# Altium schematic sheet Main.SchDoc
size A4
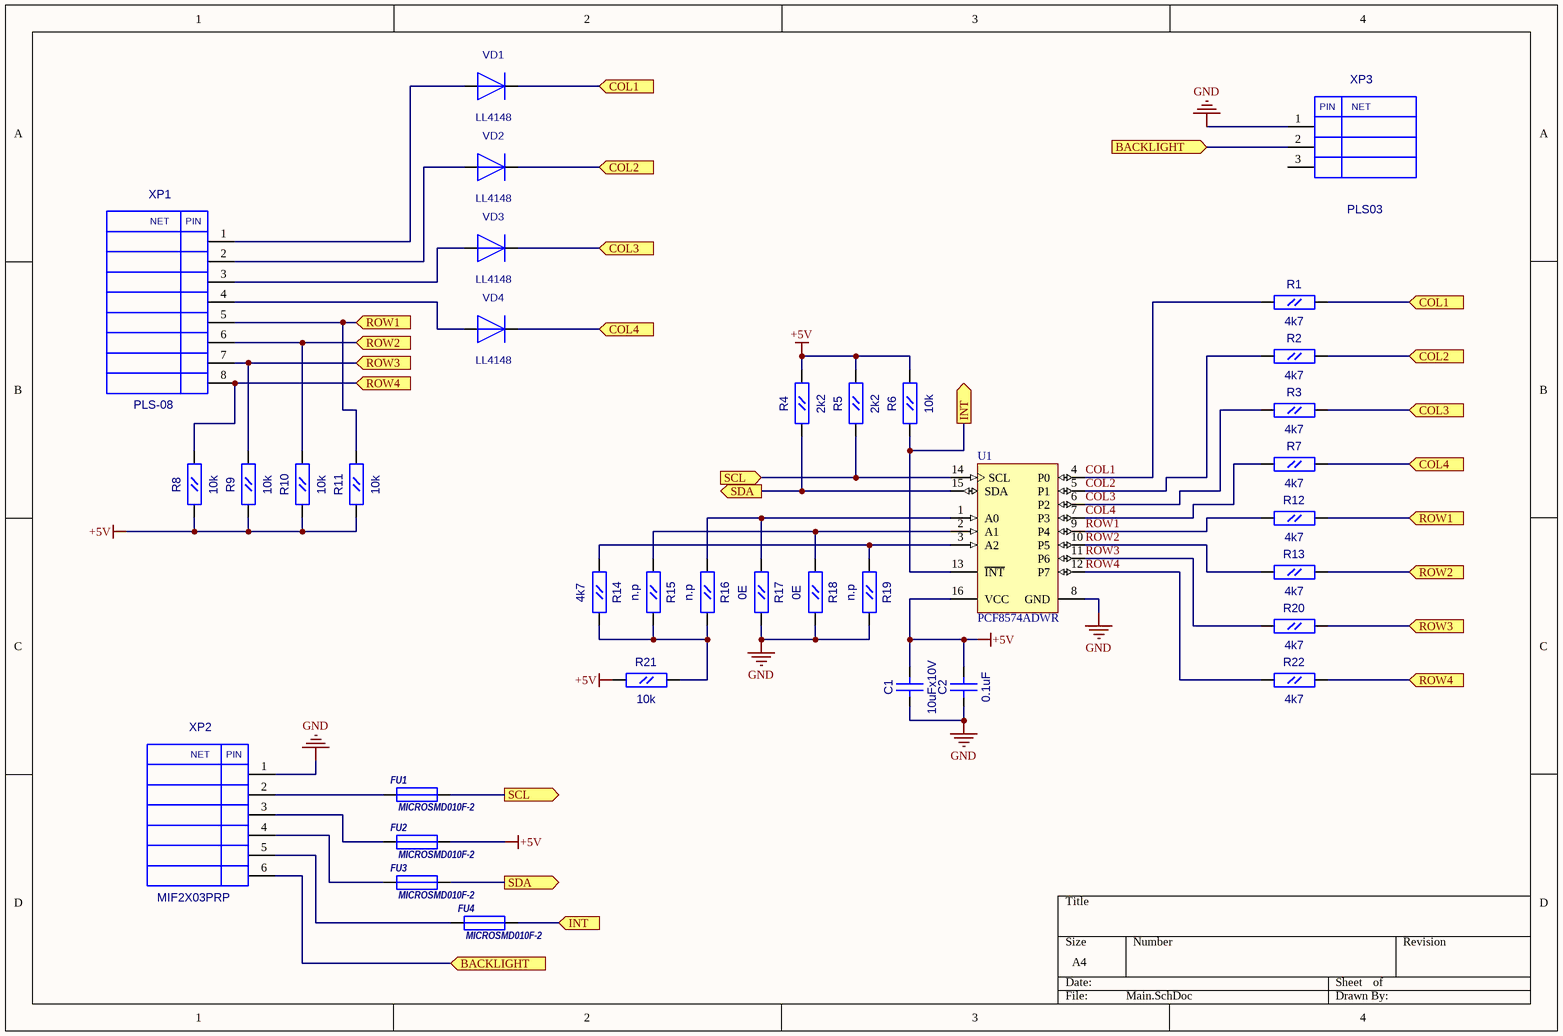
[diagram p0: Main.SchDoc]

## Parts
C1  10uFx10V  [CC0805]
C2  0.1uF  [CC0603]
FU1  MICROSMD010F-2  [RC1210]
FU2  MICROSMD010F-2  [RC1210]
FU3  MICROSMD010F-2  [RC1210]
FU4  MICROSMD010F-2  [RC1210]
R1  4k7  [RC0603]
R2  4k7  [RC0603]
R3  4k7  [RC0603]
R4  2k2  [RC0603]
R5  2k2  [RC0603]
R6  10k  [RC0603]
R7  4k7  [RC0603]
R8  10k  [RC0603]
R9  10k  [RC0603]
R10  10k  [RC0603]
R11  10k  [RC0603]
R12  4k7  [RC0603]
R13  4k7  [RC0603]
R14  4k7  [RC0603]
R15  n.p  [RC0603]
R16  n.p  [RC0603]
R17  0E  [RC0603]
R18  0E  [RC0603]
R19  n.p  [RC0603]
R20  4k7  [RC0603]
R21  10k  [RC0603]
R22  4k7  [RC0603]
U1  PCF8574ADWR  [DW16_N]
VD1  LL4148  [SOD-80]
VD2  LL4148  [SOD-80]
VD3  LL4148  [SOD-80]
VD4  LL4148  [SOD-80]
XP1  PLS-08  [PLS-08]
XP2  MIF2X03PRP  [MIF2X03PRP]
XP3  PLS03  [PLS-03]

## Ports
BACKLIGHT (in), COL1 (in), COL2 (in), COL3 (in), COL4 (in), INT (in), INT (out), ROW1 (in), ROW2 (in), ROW3 (in), ROW4 (in), SCL (in), SCL (out), SDA (out)

## Nets
+5V: C1.2(B) C2.2(B) FU2.2 R4.2(B) R5.2(B) R6.2(B) R8.1(A) R9.1(A) R10.1(A) R11.1(A) R21.1(A) U1.16(VCC)
GND: C1.1(A) C2.1(A) R17.2(B) R18.2(B) R19.2(B) U1.8(GND) XP2.1 XP3.1
BACKLIGHT: XP2.6 XP3.2 ; port BACKLIGHT
COL1: R1.1(A) U1.4(P0)
COL1: R1.2(B) VD1.2(+) ; port COL1  [a separate net that carries the same name]
COL2: R2.1(A) U1.5(P1)
COL2: R2.2(B) VD2.2(+) ; port COL2  [a separate net that carries the same name]
COL3: R3.1(A) U1.6(P2)
COL3: R3.2(B) VD3.2(+) ; port COL3  [a separate net that carries the same name]
COL4: R7.1(A) U1.7(P3)
COL4: R7.2(B) VD4.2(+) ; port COL4  [a separate net that carries the same name]
INT: FU4.2 R6.1(A) U1.13(~{INT}) ; port INT
ROW1: R12.1(A) U1.9(P4)
ROW1: R11.2(B) R12.2(B) XP1.5 ; port ROW1  [a separate net that carries the same name]
ROW2: R13.1(A) U1.10(P5)
ROW2: R10.2(B) R13.2(B) XP1.6 ; port ROW2  [a separate net that carries the same name]
ROW3: R20.1(A) U1.11(P6)
ROW3: R9.2(B) R20.2(B) XP1.7 ; port ROW3  [a separate net that carries the same name]
ROW4: R22.1(A) U1.12(P7)
ROW4: R8.2(B) R22.2(B) XP1.8 ; port ROW4  [a separate net that carries the same name]
SCL: FU1.2 R5.1(A) U1.14(SCL) ; port SCL
SDA: FU3.2 R4.1(A) U1.15(SDA) ; port SDA
NetFU1_1: FU1.1 XP2.2
NetFU2_1: FU2.1 XP2.3
NetFU3_1: FU3.1 XP2.4
NetFU4_1: FU4.1 XP2.5
NetR14_1: R14.1(A) R19.1(A) U1.3(A2)
NetR14_2: R14.2(B) R15.2(B) R16.2(B) R21.2(B)
NetR15_1: R15.1(A) R18.1(A) U1.2(A1)
NetR16_1: R16.1(A) R17.1(A) U1.1(A0)
NetVD1_1: VD1.1(-) XP1.1
NetVD2_1: VD2.1(-) XP1.2
NetVD3_1: VD3.1(-) XP1.3
NetVD4_1: VD4.1(-) XP1.4

Not connected (* = marked no-connect by the designer): XP3 3

## Notes on the sheet
- (in symbol MIF2X03PRP) NET; PIN
- (in symbol PLS03) PIN; NET
- (in symbol PLS-08) NET; PIN

## Library data of the parts
C1 = CC0805: Value: 10uFx10V
C2 = CC0603: Value: 0.1uF
FU1-FU4 = MICROSMD: Value: MICROSMD010F-2
R1-R22 = RC0603
  R1-R3 R7 R12-R14 R20 R22: Value: 4k7
  R4 R5: Value: 2k2
  R6 R8-R11 R21: Value: 10k
  R15 R16 R19: Value: n.p
  R17 R18: Value: 0E
U1 = PCF8574ADWR: Remote 8-Bit I/O Expander for I2C-Bus, 2.5 to 6.0 V, -40 to 85 degC, 16-pin SOIC (DW), Green (RoHS & no Sb/Br); Manufacturer: Texas Instruments; SubFamily: I2C IO Expander; Voltage Nodes(V): 5, 3.3; Interrupt Output: Yes; fSCLK(Max)(MHz): 0.1; VCC(Min)(V): 2.5; VCC(Max)(V): 6; Max Frequency(kHz): 100; I2C Address: 0111 xxx; # of I/Os: 8; DatasheetVersion: SCPS069D; PackageVersion: revG, Jan-2011; PackageReference: DW16; PackageDescription: 16-Pin Small Outline Integrated Circuit, 10.3 x 7.5 mm, Pitch 1.27 mm Pitch; Supplier 1: Digi-Key; Supplier Part Number 1: 296-13105-2-ND; Supplier 2: Digi-Key; Supplier Part Number 2: 296-13105-1-ND; Supplier 3: Digi-Key; Supplier Part Number 3: 296-13105-6-ND; Supplier 4: Newark; Supplier Part Number 4: 75C5233; Supplier 5: Mouser; Supplier Part Number 5: 595-PCF8574ADWR; Eco-Plan: Green (RoHS & no Sb/Br); Reset Input: No; Vcc range(V): 2.5 to 6.0; Push-Pull I/O Type: Yes; Mounting Technology: Surface Mount; PartNumber: PCF8574ADWR; Code_JEDEC: MS-013-AA; ComponentLink1Description: Datasheet; ComponentLink1URL: http://www.ti.com/general/docs/lit/getliterature.tsp?genericPartNumber=PCF8574A&fileType=pdf; ComponentLink2Description: Package Specification; ComponentLink2URL: http://www.ti.com/litv/pdf/msoi003g
VD1-VD4 = LL4148: Value: *
XP1 = PLS-08: Value: *
XP2 = MIF2X03PRP: Value: *
XP3 = PLS03: Value: *